# Altium schematic sheet Buck_DLS.SchDoc
size A4; SheetNumber: 4; SheetTotal: 4; CHANNEL: 0..7; Repeat: True
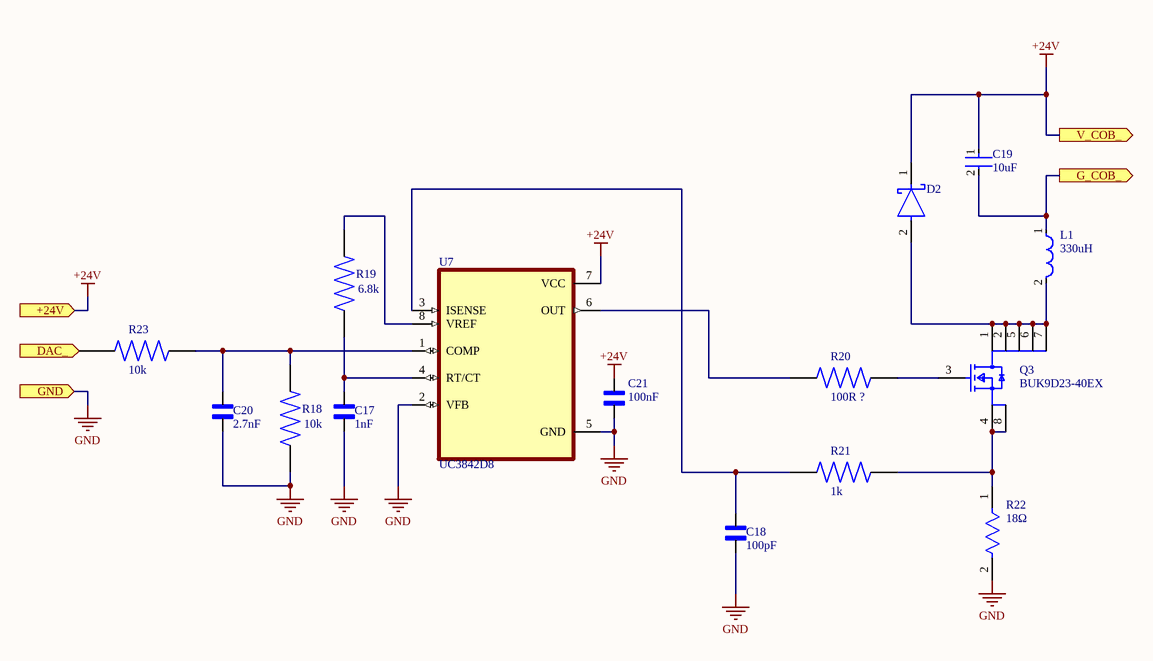
[diagram p0: Buck_DLS.SchDoc]

## Parts
C17  1nF  [CAPC2012X94N]
C18  100pF  [CAPC2012X94N]
C19  10uF  [FP-GRT319-0_15-IPC_C]
C20  2.7nF  [CAPC2012X94N]
C21  100nF  [CAPC2012X94N]
D2  (no value)  [FP-SOD123W-MFG]
L1  330uH  [FP-SRR1260-MFG]
Q3  BUK9D23-40EX  [FP-SOT1220-MFG]
R18  10k  [RES_ERJ6ENF1002V]
R19  6.8k  [RES_ERJ6ENF1002V]
R20  100R ?  [RES_ERJ6ENF1002V]
R21  1k  [RES_ERJ6ENF1002V]
R22  18Ω  [FP-CRGP1206-IPC_C]
R23  10k  [RES_ERJ6ENF1002V]
U7  UC3842D8  [SOIC127P599X175-8N]

## Ports
+24V (in, see Main_DLS[3B], MCU_DLS[7C]), DAC_ (in, see Main_DLS[3B]), G_COB_ (out, see Main_DLS[4C]), GND (in, see Main_DLS[3B], MCU_DLS[7C]), V_COB_ (out, see Main_DLS[4C])

## Nets
+24V: C19.1 C21.2 D2.1(C) U7.7(VCC) ; port V_COB_, port +24V
GND: C17.1 C18.1 C20.1 C21.1 R18.1 R22.2 U7.2(VFB) U7.5(GND) ; port GND
DAC_: R23.1 ; port DAC_
G_COB_: C19.2 L1.1 ; port G_COB_
NetC17_2: C17.2 R19.1 U7.4(RT/CT)
NetC18_2: C18.2 R21.1 U7.3(ISENSE)
NetC20_2: C20.2 R18.2 R23.2 U7.1(COMP)
NetD2_2: D2.2(A) L1.2 Q3.1(D) Q3.2(D) Q3.5(D) Q3.6(D) Q3.7(D)
NetQ3_3: Q3.3(G) R20.2
NetQ3_4: Q3.4(S) Q3.8(S) R21.2 R22.1
NetR19_2: R19.2 U7.8(VREF)
NetR20_1: R20.1 U7.6(OUT)

## Library data of the parts
C17 C18 C20 C21 = 08055C104KAT2A: Capacitor;Ceramic;0.1uF;10%;50V;Tape/Reel | AVX 08055C104KAT2A; SnapEDA_Link: https://www.snapeda.com/parts/08055C104KAT2A/AVX/view-part/?ref=snap; Package: 2012 AVX; Value: *; MF: AVX; MP: 08055C104KAT2A; Check_prices: https://www.snapeda.com/parts/08055C104KAT2A/AVX/view-part/?ref=eda
C19 = CMP-06035-050745-1: Multi-Layer Ceramic Capacitor 10uF 35V X5R ±10% 1206 Paper T/R - GRT319R6YA106KE01J
D2 = CMP-14398-000026-1: DIODE SCHOTTKY 40V 3A SOD123W, PMEG4030ER,115; RoHS Compliant: Yes
L1 = CMP-2000-07146-2: FIXED IND 15UH 5A 27 MOHM SMD; Q Factor: 25; Sample Rate (Hz): 100kHz; Resistance: 27MR; Material: Steel; Inductance Tolerance: 20%; Frequency: 17.6MHz; Saturation Current: 4.6A; Core Material: Ferrite; Shielding: Shielded; Series: SRR1260; Termination: SMD/SMT; Packaging: Tape and Reel; RoHS Compliant: Yes; Height - Seated (Max): 0.256inch; Depth: 12.8mm; Case/Package: 1260; Inductance: 15uH; Height: 6mm; Number of Pins: 2; Mount: Surface Mount; Min Operating Temperature: -40°C; Test Frequency: 100kHz; Length: 12.5mm; Self Resonant Frequency: 17.6MHz; Current Rating: 5A; Tolerance: 20%; RMS Current (Irms): 5A; REACH SVHC: No SVHC; Resistor Type: Wirewound; DC Resistance (DCR): 27mR; Width: 12.5mm; Package Quantity: 600; DC Current: 5A; Max DC Current: 5A; Max Operating Temperature: 125°C; Military Standard: Not
Q3 = CMP-14409-000007-1: MOSFET N-CH 40V 8A 6DFN2020MD; Manufacturer: Nexperia; Rthja Max: 57K/W; Gate Charge At Vgs: 11.5nC @ 10V; Reverse Recovery Charge: 5.3nC; Turn On Delay Time: 2ns; Number Of N Channels: 1; Drain To Source Resistance: 18mΩ; Reverse Recovery Time: 12.9ns; Transconductance: 39S; Automotive Grade: Grade 0; Turn Off Delay Time: 12ns; Typ Forward Diode Voltage: 0.8V; Max Junction Temp: +175°C; Max Forward Diode Voltage: 1.2V; Gate To Source Voltage: 15V; Input Capacitace At Vds: 637pF @ 20V; Power Dissipation: 2.3W; Threshold Vgs Max: 2.1V; Depletion Mode: False; Threshold Vgs Min: 1.4V; Pulse Drain Current: 76A; Drain To Source Breakdown Voltage: 40V; RoHS: TRUE; Ambient Temperature Range Low: -55°C; Height: 0.65mm; Drain To Source Voltage: 40V; Temperature: -55°C to +175°C; Number Of Channels: 1; Automotive: Yes; Footprint Url: https://assets.nexperia.com/documents/outline-drawing/SOT1220.pdf; Digikey Description: MOSFET N-CH 40V 8A 6DFN2020MD; Device Class L1: Discrete Semiconductors; Manufacturer Part Number: BUK9D23-40EX; Package: SOT1220; ComponentLink2URL: https://assets.nexperia.com/documents/data-sheet/BUK9D23-40E.pdf; Category: Trans; Lead Free: Yes; Continuous Drain Current: 8A; Temperature Range Low: -55°C; Temperature Range High: +175°C; Device Class L2: Transistors; Device Class L3: MOSFETs; Octopart: https://octopart.com/buk9d23-40ex-nexperia-87872643; ComponentLink2Description: Datasheet; Ambient Temperature Range High: +175°C
R18-R20 R23 = ERJ6ENF1002V: 10 kOhms Â±1% 0.125W, 1/8W Chip Resistor 0805 (2012 Metric) Automotive AEC-Q200 Thick Film; MF: Panasonic; Check_prices: https://www.snapeda.com/parts/ERJ6ENF1002V/Panasonic/view-part/5776803/?ref=eda; SnapEDA_Link: https://www.snapeda.com/parts/ERJ6ENF1002V/Panasonic/view-part/5776803/?ref=snap; Value: *; Digi-Key_Part_Number: P10.0KCCT-ND; MP: ERJ6ENF1002V; Package: 2012-2 Panasonic
R21 = ERJ6ENF1002V: 1kOhm Â±1% 0.125W, 1/8W Chip Resistor 0805 (2012 Metric); MF: Panasonic; Check_prices: https://www.snapeda.com/parts/ERJ6ENF1002V/Panasonic/view-part/5776803/?ref=eda; SnapEDA_Link: https://www.snapeda.com/parts/ERJ6ENF1002V/Panasonic/view-part/5776803/?ref=snap; Value: *; Digi-Key_Part_Number: P10.0KCCT-ND; MP: ERJ6ENF1002V; Package: 2012-2 Panasonic
R22 = CMP-03211-005493-1: CRGP1206F18R - CRGP1206 18Ω 0.5W ±100ppm/°C 1% 200V; Manufacturer: TE; Tolerance: 0.01; ComponentLink2Description: Datasheet; Ipc Land Pattern Name: RESC310155X55; RoHS: TRUE; Power Rating: 0.5W; Value: 18Ω; Octopart: https://octopart.com/crgp1206f18r-te+connectivity-91018856; Resistance: 18Ω; Device Class L3: Chip SMD Resistors; Temperature Range Low: -55°C; Voltage Rating: 200V; Series: CRGP; Ambient Temperature Range High: +70°C; Category: Res; Package: CRGP1206; ComponentLink2URL: https://www.mouser.com/datasheet/2/418/NG_DS_9-1773463-9_A-1358566.pdf; Device Class L2: Resistors; Device Class L1: Passive Components; Manufacturer Part Number: CRGP1206F18R; Height: 0.65mm; Temperature Coefficient: ±100ppm/°C; Temperature: -55°C to +155°C; Automotive: No; Lead Free: Yes; Temperature Range High: +155°C; Composition: Thick Film
U7 = UC3842D8: Single ended 500KHz current mode PWM controller with 16V/10V UVLO 100% duty cycle, 0C to 70C; MF: Texas Instruments; SnapEDA_Link: https://www.snapeda.com/parts/UC3842D8/Texas+Instruments/view-part/?ref=snap; Package: SOIC-8 Texas Instruments; Value: *; MP: UC3842D8; Check_prices: https://www.snapeda.com/parts/UC3842D8/Texas+Instruments/view-part/?ref=eda